# EAGLE schematic schematic (EAGLE 9.7.0)
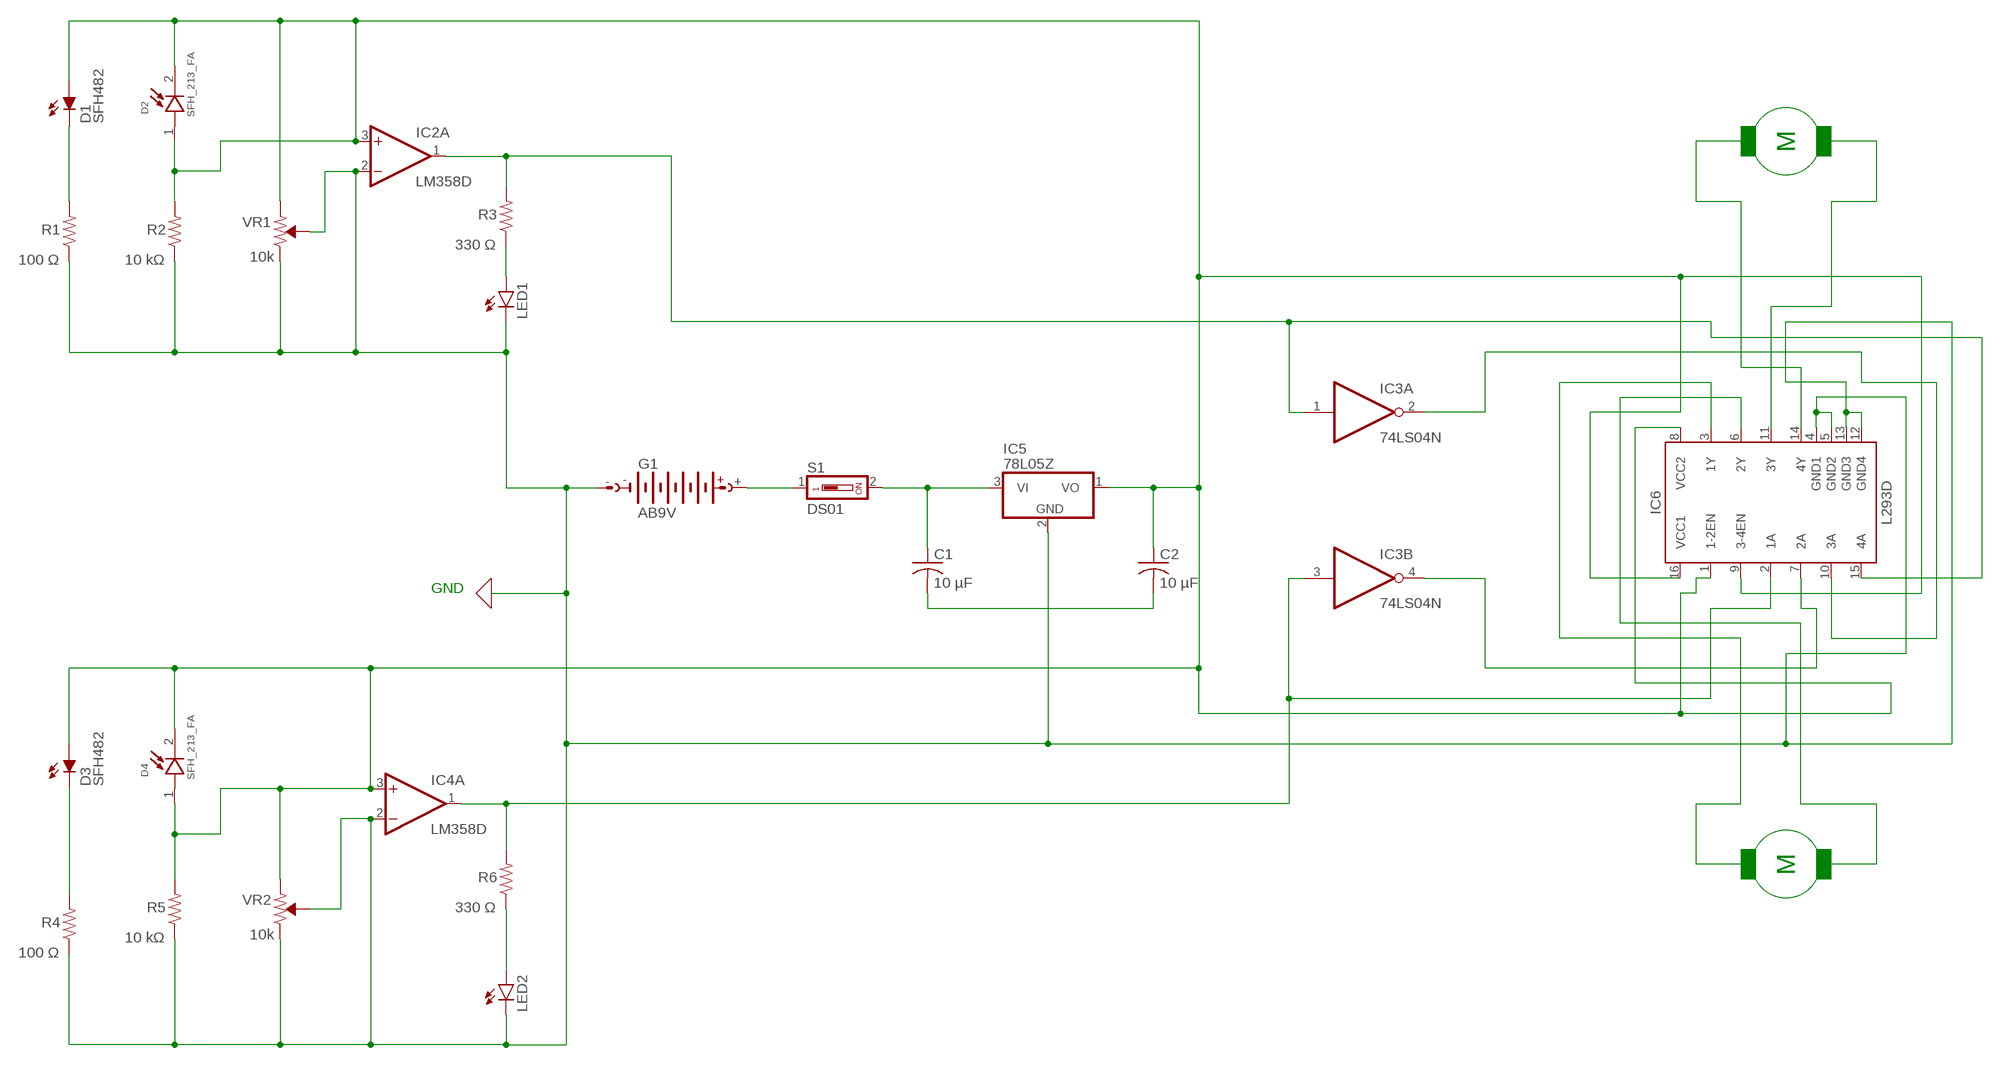
[diagram p0: schematic, sheet 1]

## Parts
C1  10 µF  C-US025-025X050  [C025-025X050]
C2  10 µF  C-US025-025X050  [C025-025X050]
D1  SFH482  [SFH482]
D2  SFH_213_FA  [XDCR_SFH_213_FA]
D3  SFH482  [SFH482]
D4  SFH_213_FA  [XDCR_SFH_213_FA]
G1  AB9V  [AB9V]
IC2  LM358D  [SO08]
IC3  74LS04N  [DIL14]
IC4  LM358D  [SO08]
IC5  78L05Z  [TO92]
IC6  L293D  [DIP762W53P254L1969H508Q16B]
LED1  LED5MM  [LED5MM]
LED2  LED5MM  [LED5MM]
R1  100 Ω  R-US_0204/7  [0204/7]
R2  10 kΩ  R-US_0204/7  [0204/7]
R3  330 Ω  R-US_0204/7  [0204/7]
R4  100 Ω  R-US_0204/7  [0204/7]
R5  10 kΩ  R-US_0204/7  [0204/7]
R6  330 Ω  R-US_0204/7  [0204/7]
S1  DS01  [DS-01]
VR1  10k  TRIMPOT-SMD-3MM-OPEN-1/10W-25%  [TRIMPOT-SMD-TC33X]
VR2  10k  TRIMPOT-SMD-3MM-OPEN-1/10W-25%  [TRIMPOT-SMD-TC33X]

## Nets
0: G1.- IC2.2(A:-IN) IC4.2(A:-IN) IC5.2(GND) IC6.4(GND1) IC6.5(GND2) IC6.12(GND4) IC6.13(GND3) LED1.K(C) LED2.K(C) R1.1 R2.1 R4.1 R5.1 VR1.1(CW) VR1.2(WIPER) VR2.1(CW) VR2.2(WIPER) ; supply symbol labelled GND
N$1: C1.1 IC5.3(VI) S1.2
N$2: C2.1 D1.A D2.1(A) D2.2(C) D3.A D4.1(A) D4.2(C) IC2.3(A:+IN) IC4.3(A:+IN) IC5.1(VO) IC6.1(1-2EN) IC6.8(VCC2) IC6.9(3-4EN) IC6.16(VCC1) R2.2 R5.2 VR1.3(CCW) VR2.3(CCW)
N$3: C1.2 C2.2
N$4: IC3.2(A:O) IC6.10(3A)
N$5: IC3.4(B:O) IC6.7(2A)
N$6: IC6.3(1Y) IC6.14(4Y)
N$7: D1.K(C) R1.2
N$8: G1.+ S1.1
N$10: IC6.6(2Y) IC6.11(3Y)
N$11: LED1.A R3.1
N$12: LED2.A R6.1
N$13: D3.K(C) R4.2
N$18: IC2.1(A:OUT) IC3.1(A:I) IC6.15(4A) R3.2
N$19: IC3.3(B:I) IC4.1(A:OUT) IC6.2(1A) R6.2
Unconnected: IC2.5(B:+IN) IC2.6(B:-IN) IC2.7(B:OUT) IC3.5(C:I) IC3.6(C:O) IC3.8(D:O) IC3.9(D:I) IC3.10(E:O) IC3.11(E:I) IC3.12(F:O) IC3.13(F:I) IC4.5(B:+IN) IC4.6(B:-IN) IC4.7(B:OUT)

## Notes on the sheet
- M
- GND
- M

## Power pins joined to a net without a drawn wire
GND: IC3.7(P:GND)
V+: IC2.8(P:V+) IC4.8(P:V+)
V-: IC2.4(P:V-) IC4.4(P:V-)
VCC: IC3.14(P:VCC)

## Library data of the parts
C1 C2 = rcl:C-US: CAPACITOR, American symbol; SPICEPREFIX: C
D1 D3 = SnapEDA Library:SFH482: IR LED infrared emitting diode, Infineon
D2 D4 = SFH_213_FA:SFH_213_FA: PIN IR photodiode; 5mm; 750-1100nm; 150mW; 10°; λp max: 900nm; 1mm; CHECK_PRICES: https://www.snapeda.com/parts/SFH%20213%20FA/OSRAM+Opto+Semiconductors+Inc./view-part/?ref=eda; DESCRIPTION: Photodiode 900nm 5ns 20° Radial; MF: OSRAM Opto; MP: SFH 213 FA; PACKAGE: Radial Osram Opto; PURCHASE-URL: https://www.snapeda.com/api/url_track_click_mouser/?unipart_id=232958&manufacturer=OSRAM Opto&part_name=SFH 213 FA&search_term=photodiode; RS_COMPONENTS_70339007_PURCHASE_URL: https://www.snapeda.com/api/url_track_click/https%253A//us.rs-online.com/product/osram-opto-semiconductors/sfh-213-fa/70339007/%253Futm_source%253DSnapEDA%2526utm_medium%253Dpart_sourcing%2526utm_campaign%253Dpartsourcing_SnapEDA_IMP_EX_GR/?unipart_id=232958&manufacturer=OSRAM Opto&part_name=SFH 213 FA&search_term=photodiode; SNAPEDA_LINK: https://www.snapeda.com/parts/SFH%20213%20FA/OSRAM+Opto+Semiconductors+Inc./view-part/?ref=snap
G1 = battery:AB9V: 9-V BATTERY CLIP
IC2 IC4 = linear:LM358: OP AMP also LM158; LM258; LM2904 Source: http://cache.national.com/ds/LM/LM158.pdf
IC3 = 74xx-eu:74*04: Hex INVERTER
IC5 = linear:78*: Positive VOLTAGE REGULATOR Source: http://cache.national.com/ds/LM/LM78L05.pdf http://www.fairchildsemi.com/ds/LM/LM7805.pdf
IC6 = IC_Power-Management:L293: L293D H-bridge motor driver Datasheet <https://www.ti.com/lit/ds/symlink/l293.pdf>; CATEGORY: IC_Linear; DESCRIPTION: IC MTRDRV BIPLR 4.5-36V 16PWRDIP; MANUFACTURER: STMicroelectronics; MPN: L293D; OPERATING_TEMP: -40°C ~ 150°C; PART_STATUS: Active; ROHS_COMPLIANT: ROHS3 Compliant; SERIES: L293; SUB-CATEGORY: Motor Driver; TYPE: Bipolar
LED1 LED2 = led:LED: LED OSRAM: - CHIPLED LG R971, LG N971, LY N971, LG Q971, LY Q971, LO R971, LY R971 LH N974, LH R974 LS Q976, LO Q976, LY Q976 LO Q996 - Hyper CHIPLED LW Q18S LB Q993, LB Q99A, LB R99A - SideLED LS A670, LO A670, LY A670, LG A670, LP A670 LB A673, LV A673, LT A673, LW A673 LH A674 LY A675 LS A676, LA A676, LO A676, LY A676, LW A676 LS A679, LY A679, LG A679 - Hyper Micro SIDELED® LS Y876, LA Y876, LO Y876, LY Y876 LT Y87S - SmartLED LW L88C, LW L88S LB L89C, LB L89S, LG L890 LS L89K, LO L89K, LY L89K LS L896, LA L896, LO L896, LY L896 - TOPLED LS T670, LO T670, LY T670, LG T670, LP T670 LSG T670, LSP T670, LSY T670, LOP T670, LYG T670 LG T671, LOG T671, LSG T671 LB T673, LV T673, LT T673, LW T673 LH T674 LS T676, LA T676, LO T676, LY T676, LB T676, LH T676, LSB T676, LW T676 LB T67C, LV T67C, LT T67C, LS T67K, LO T67K, LY T67K, LW E67C LS E67B, LA E67B, LO E67B, LY E67B, LB E67C, LV E67C, LT E67C LW T67C LS T679, LY T679, LG T679 LS T770, LO T770, LY T770, LG T770, LP T770 LB T773, LV T773, LT T773, LW T773 LH T774 LS E675, LA E675, LY E675, LS T675 LS T776, LA T776, LO T776, LY T776, LB T776 LHGB T686 LT T68C, LB T68C - Hyper Mini TOPLED® LB M676 - Mini TOPLED Santana® LG M470 LS M47K, LO M47K, LY M47K Source: http://www.osram.convergy.de LUXEON: - LUMILED® LXK2-PW12-R00, LXK2-PW12-S00, LXK2-PW14-U00, LXK2-PW14-V00 LXK2-PM12-R00, LXK2-PM12-S00, LXK2-PM14-U00 LXK2-PE12-Q00, LXK2-PE12-R00, LXK2-PE12-S00, LXK2-PE14-T00, LXK2-PE14-U00 LXK2-PB12-K00, LXK2-PB12-L00, LXK2-PB12-M00, LXK2-PB14-N00, LXK2-PB14-P00, LXK2-PB14-Q00 LXK2-PR12-L00, LXK2-PR12-M00, LXK2-PR14-Q00, LXK2-PR14-R00 LXK2-PD12-Q00, LXK2-PD12-R00, LXK2-PD12-S00 LXK2-PH12-R00, LXK2-PH12-S00 LXK2-PL12-P00, LXK2-PL12-Q00, LXK2-PL12-R00 Source: www.luxeon.com KINGBRIGHT: KA-3528ASYC Source: www.kingbright.com
R1-R6 = rcl:R-US_: RESISTOR, American symbol; SPICEPREFIX: R
S1 = Switch:DS01: DIL/CODE SWITCH; CATEGORY: SWITCH; TYPE: SPST
VR1 VR2 = SparkFun-Resistors:TRIMPOT: Trimming Potentiometer (Trimpot) Three-terminal potentiometers, with an adjustable wiper and two adjustable resistors. A pot can be used to create a configurable voltage divider, or as a variable resistor. "Trimpots" are a subset of potentiometers, usually intended for "set-and-forget" applications. They're often more delicate than standard potentiometers - rated for fewer turns. Variants PTH-KNOB - PTH Trimpot w/ finger-adjustable knob Trimpot 10K with Knob <https://www.sparkfun.com/products/9806> (COM-09806) Datasheet <http://www.sparkfun.com/datasheets/Components/General/TSR-3386.pdf> SMD-3MM-CLOSED-FRAME - SMD 3mm Square Closed-Frame Trimpot Used on e.g. EasyDriver - Stepper Motor Driver <https://www.sparkfun.com/products/12779> Datasheet <http://www.bitechnologies.com/pdfs/22.pdf> (22AR10KTR) SMD-5MM - SMD 5mm Square Closed-Frame Trimpot Used on e.g. IOIO-OTG - V2.2 <https://www.sparkfun.com/products/13613> Datasheet <http://www.vishay.com/docs/51008/ts53.pdf> (TS53YL502MR10) SMD-3MM-1/10W-25% - 3mm Square Open-Frame Trimpot Used on e.g. SparkFun Shapeoko <https://www.sparkfun.com/products/13899> Datasheet <http://www.bourns.com/docs/Product-Datasheets/TC33.pdf> (TC33X-2-103E); PROD_ID: RES-12428, RES-08048